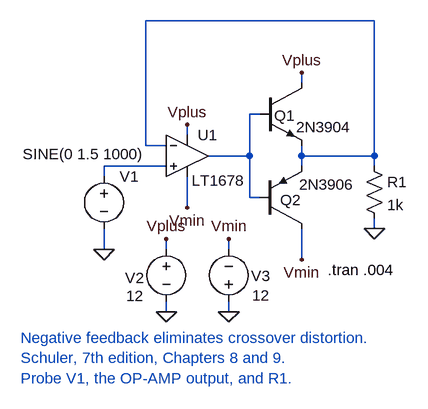
[diagram p0: schematic CrossDist.asc]
CrossDist.asc, the LTspice schematic file:
Version 4
SHEET 1 880 680
WIRE 400 0 48 0
WIRE 288 96 288 80
WIRE 224 144 208 144
WIRE 112 176 112 160
WIRE 48 192 48 0
WIRE 80 192 48 192
WIRE 208 208 208 144
WIRE 208 208 144 208
WIRE 288 208 288 192
WIRE 400 208 400 0
WIRE 400 208 288 208
WIRE 80 224 -16 224
WIRE 288 224 288 208
WIRE 400 224 400 208
WIRE -16 240 -16 224
WIRE 208 272 208 208
WIRE 224 272 208 272
WIRE 112 288 112 240
WIRE 400 320 400 304
WIRE -16 352 -16 320
WIRE 80 352 80 336
WIRE 176 352 176 336
WIRE 288 368 288 320
WIRE 80 448 80 432
WIRE 176 448 176 432
FLAG -16 352 0
FLAG 400 320 0
FLAG 112 160 Vplus
FLAG 288 80 Vplus
FLAG 112 288 Vmin
FLAG 288 368 Vmin
FLAG 80 448 0
FLAG 176 448 0
FLAG 80 336 Vplus
FLAG 176 336 Vmin
SYMBOL Opamps\\LT1678 112 208 R0
WINDOW 3 7 38 Left 0
SYMATTR InstName U1
SYMBOL npn 224 96 R0
WINDOW 0 22 50 Left 0
SYMATTR InstName Q1
SYMATTR Value 2N3904
SYMBOL pnp 224 320 M180
WINDOW 0 31 44 Left 0
WINDOW 3 60 68 Left 0
SYMATTR InstName Q2
SYMATTR Value 2N3906
SYMBOL res 384 208 R0
SYMATTR InstName R1
SYMATTR Value 1k
SYMBOL voltage -16 224 R0
WINDOW 3 -125 -19 Left 0
WINDOW 123 0 0 Left 0
WINDOW 39 0 0 Left 0
SYMATTR InstName V1
SYMATTR Value SINE(0 1.5 1000)
SYMBOL voltage 80 336 R0
WINDOW 0 -63 60 Left 0
WINDOW 3 -62 88 Left 0
WINDOW 123 0 0 Left 0
WINDOW 39 0 0 Left 0
SYMATTR InstName V2
SYMATTR Value 12
SYMBOL voltage 176 448 R180
WINDOW 0 -64 55 Left 0
WINDOW 3 -63 25 Left 0
WINDOW 123 0 0 Left 0
WINDOW 39 0 0 Left 0
SYMATTR InstName V3
SYMATTR Value 12
TEXT 328 384 Left 0 !.tran .004
TEXT -144 488 Left 0 ;Negative feedback eliminates crossover distortion.\nSchuler, 7th edition, Chapters 8 and 9.\nProbe V1, the OP-AMP output, and R1.

The netlist it stands for:
* CrossDist.asc
XU1 N003 N001 N002 Vplus Vmin LT1678  ; pins In+ In- OUT V+ V-
Q1 Vplus N002 N001 0 2N3904
Q2 Vmin N002 N001 0 2N3906
R1 N001 0 1k
V1 N003 0 SINE(0 1.5 1000)
V2 Vplus 0 12
V3 0 Vmin 12
.model NPN NPN
.model PNP PNP
.lib standard.bjt
.tran .004
* Negative feedback eliminates crossover distortion.
* Schuler, 7th edition, Chapters 8 and 9.
* Probe V1, the OP-AMP output, and R1.
.backanno
.end